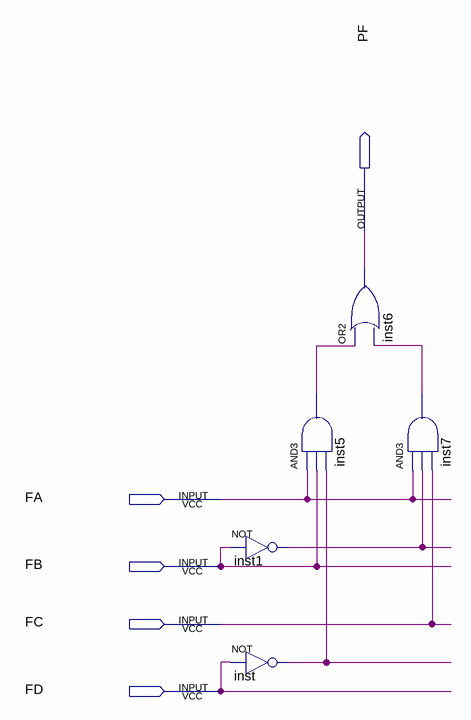
[diagram p0: schematic sheet]
// Quartus schematic ColunaF.bdf as structural Verilog: 5 symbols, 5 pins
module ColunaF (
  input  FA,
  input  FB,
  input  FC,
  input  FD,
  output PF
);

  wire inst1_out, inst5_out, inst7_out, inst_out;

  not inst1 (inst1_out, FB);
  not inst (inst_out, FD);
  and inst5 (inst5_out, FA, FB, inst_out);
  or inst6 (PF, inst5_out, inst7_out);
  and inst7 (inst7_out, FA, inst1_out, FC);
endmodule
